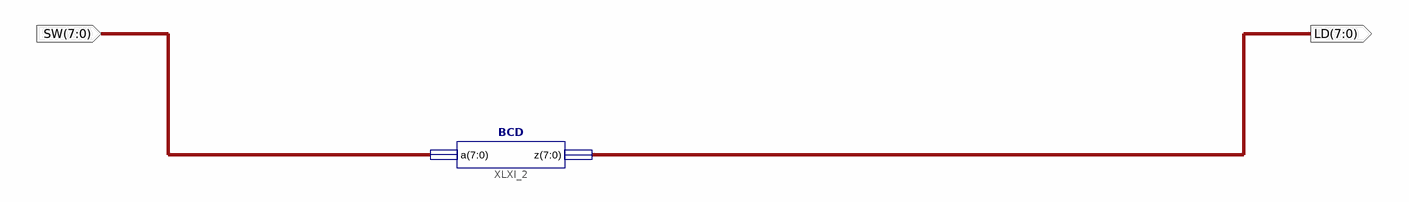
[diagram p0: schematic sheet 1]
// Xilinx ISE schematic schema.sch (spartan3e) as structural Verilog: 1 symbols, 2 ports
module schema (
  input  [7:0] SW,
  output [7:0] LD
);

  BCD XLXI_2 (.a(SW), .z(LD));
endmodule
